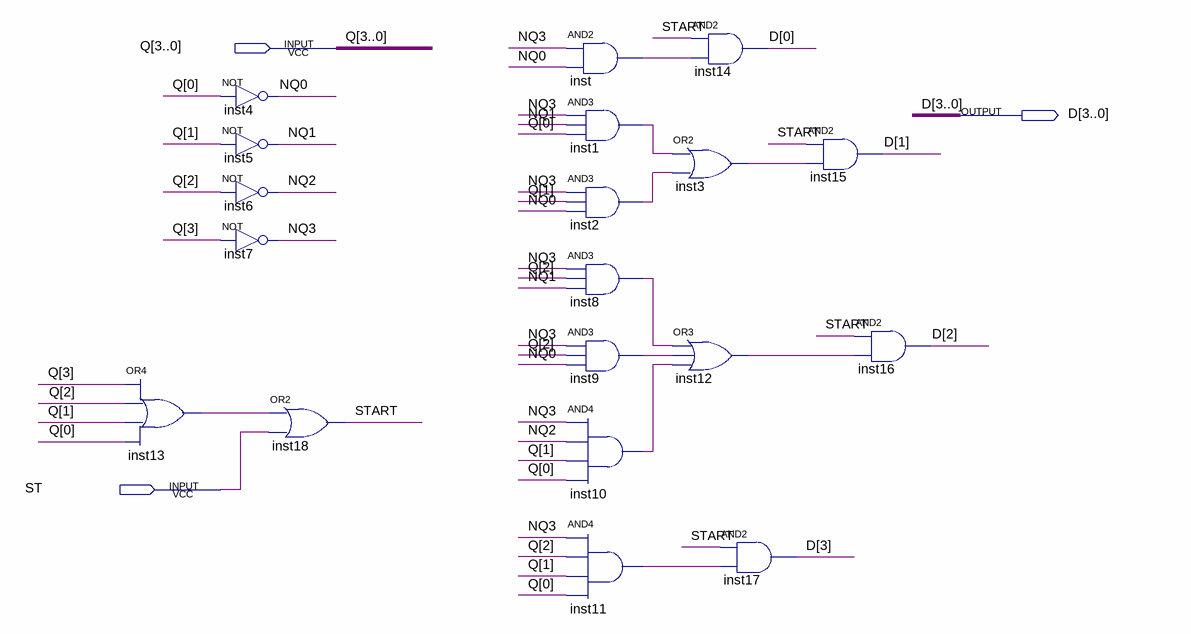
[diagram p0: schematic sheet]
// Quartus schematic NextState.bdf as structural Verilog: 19 symbols, 3 pins
module NextState (
  input  [3:0] Q,
  input  ST,
  output [3:0] D
);

  wire inst1_out, inst2_out, inst3_out, inst8_out, inst9_out, inst10_out, inst11_out, inst12_out, inst13_out,
       inst_out, NQ0, NQ1, NQ2, NQ3, START;

  or inst13 (inst13_out, Q[3], Q[2], Q[1], Q[0]);
  not inst4 (NQ0, Q[0]);
  not inst5 (NQ1, Q[1]);
  not inst6 (NQ2, Q[2]);
  not inst7 (NQ3, Q[3]);
  or inst18 (START, inst13_out, ST);
  and inst (inst_out, NQ3, NQ0);
  and inst1 (inst1_out, NQ3, NQ1, Q[0]);
  and inst2 (inst2_out, NQ3, Q[1], NQ0);
  and inst8 (inst8_out, NQ3, Q[2], NQ1);
  and inst9 (inst9_out, NQ3, Q[2], NQ0);
  and inst10 (inst10_out, NQ3, NQ2, Q[1], Q[0]);
  and inst11 (inst11_out, NQ3, Q[2], Q[1], Q[0]);
  and inst14 (D[0], START, inst_out);
  or inst3 (inst3_out, inst1_out, inst2_out);
  or inst12 (inst12_out, inst8_out, inst9_out, inst10_out);
  and inst17 (D[3], START, inst11_out);
  and inst15 (D[1], START, inst3_out);
  and inst16 (D[2], START, inst12_out);
endmodule
